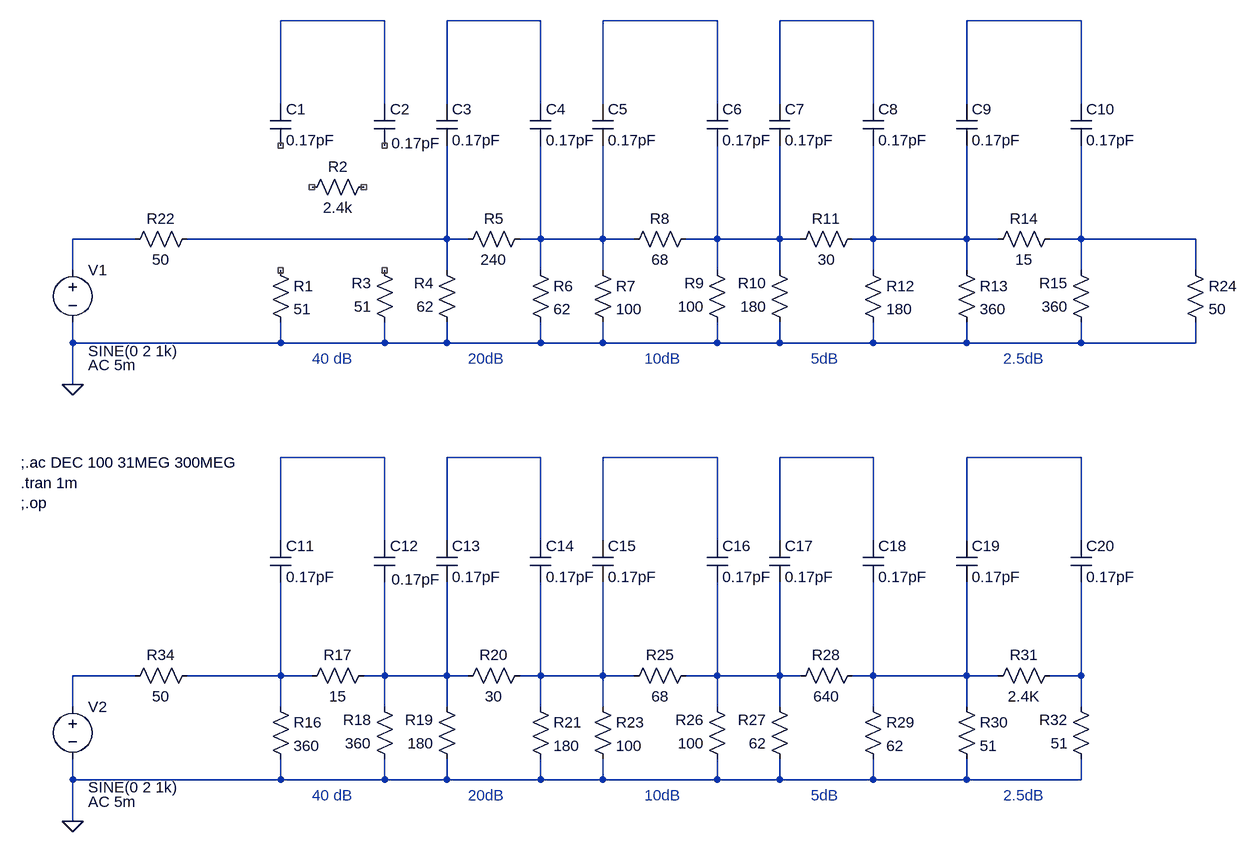
[diagram p0: schematic AttenuatorDesignSim.asc]
AttenuatorDesignSim.asc, the LTspice schematic file:
Version 4
SHEET 1 2180 1200
WIRE 272 -48 112 -48
WIRE 512 -48 368 -48
WIRE 784 -48 608 -48
WIRE 1024 -48 880 -48
WIRE 1344 -48 1168 -48
WIRE 112 80 112 -48
WIRE 272 80 272 -48
WIRE 368 80 368 -48
WIRE 512 80 512 -48
WIRE 608 80 608 -48
WIRE 784 80 784 -48
WIRE 880 80 880 -48
WIRE 1024 80 1024 -48
WIRE 1168 80 1168 -48
WIRE 1344 80 1344 -48
WIRE -112 288 -208 288
WIRE 368 288 368 144
WIRE 368 288 -32 288
WIRE 400 288 368 288
WIRE 512 288 512 144
WIRE 512 288 480 288
WIRE 608 288 608 144
WIRE 608 288 512 288
WIRE 656 288 608 288
WIRE 784 288 784 144
WIRE 784 288 736 288
WIRE 880 288 880 144
WIRE 880 288 784 288
WIRE 912 288 880 288
WIRE 1024 288 1024 144
WIRE 1024 288 992 288
WIRE 1168 288 1168 144
WIRE 1168 288 1024 288
WIRE 1216 288 1168 288
WIRE 1344 288 1344 144
WIRE 1344 288 1296 288
WIRE 1520 288 1344 288
WIRE -208 336 -208 288
WIRE 368 336 368 288
WIRE 512 336 512 288
WIRE 608 336 608 288
WIRE 784 336 784 288
WIRE 880 336 880 288
WIRE 1024 336 1024 288
WIRE 1168 336 1168 288
WIRE 1344 336 1344 288
WIRE 1520 336 1520 288
WIRE -208 448 -208 416
WIRE 112 448 112 416
WIRE 112 448 -208 448
WIRE 272 448 272 416
WIRE 272 448 112 448
WIRE 368 448 368 416
WIRE 368 448 272 448
WIRE 512 448 512 416
WIRE 512 448 368 448
WIRE 608 448 608 416
WIRE 608 448 512 448
WIRE 784 448 784 416
WIRE 784 448 608 448
WIRE 880 448 880 416
WIRE 880 448 784 448
WIRE 1024 448 1024 416
WIRE 1024 448 880 448
WIRE 1168 448 1168 416
WIRE 1168 448 1024 448
WIRE 1344 448 1344 416
WIRE 1344 448 1168 448
WIRE 1520 448 1520 416
WIRE 1520 448 1344 448
WIRE -208 512 -208 448
WIRE 272 624 112 624
WIRE 512 624 368 624
WIRE 784 624 608 624
WIRE 1024 624 880 624
WIRE 1344 624 1168 624
WIRE 112 752 112 624
WIRE 272 752 272 624
WIRE 368 752 368 624
WIRE 512 752 512 624
WIRE 608 752 608 624
WIRE 784 752 784 624
WIRE 880 752 880 624
WIRE 1024 752 1024 624
WIRE 1168 752 1168 624
WIRE 1344 752 1344 624
WIRE -112 960 -208 960
WIRE 112 960 112 816
WIRE 112 960 -32 960
WIRE 160 960 112 960
WIRE 272 960 272 816
WIRE 272 960 240 960
WIRE 368 960 368 816
WIRE 368 960 272 960
WIRE 400 960 368 960
WIRE 512 960 512 816
WIRE 512 960 480 960
WIRE 608 960 608 816
WIRE 608 960 512 960
WIRE 656 960 608 960
WIRE 784 960 784 816
WIRE 784 960 736 960
WIRE 880 960 880 816
WIRE 880 960 784 960
WIRE 912 960 880 960
WIRE 1024 960 1024 816
WIRE 1024 960 992 960
WIRE 1168 960 1168 816
WIRE 1168 960 1024 960
WIRE 1216 960 1168 960
WIRE 1344 960 1344 816
WIRE 1344 960 1296 960
WIRE -208 1008 -208 960
WIRE 112 1008 112 960
WIRE 272 1008 272 960
WIRE 368 1008 368 960
WIRE 512 1008 512 960
WIRE 608 1008 608 960
WIRE 784 1008 784 960
WIRE 880 1008 880 960
WIRE 1024 1008 1024 960
WIRE 1168 1008 1168 960
WIRE 1344 1008 1344 960
WIRE -208 1120 -208 1088
WIRE 112 1120 112 1088
WIRE 112 1120 -208 1120
WIRE 272 1120 272 1088
WIRE 272 1120 112 1120
WIRE 368 1120 368 1088
WIRE 368 1120 272 1120
WIRE 512 1120 512 1088
WIRE 512 1120 368 1120
WIRE 608 1120 608 1088
WIRE 608 1120 512 1120
WIRE 784 1120 784 1088
WIRE 784 1120 608 1120
WIRE 880 1120 880 1088
WIRE 880 1120 784 1120
WIRE 1024 1120 1024 1088
WIRE 1024 1120 880 1120
WIRE 1168 1120 1168 1088
WIRE 1168 1120 1024 1120
WIRE 1344 1120 1344 1088
WIRE 1344 1120 1168 1120
WIRE -208 1184 -208 1120
FLAG -208 512 0
FLAG -208 1184 0
DATAFLAG -160 288 "$"
DATAFLAG 1408 288 "$"
DATAFLAG -160 960 "$"
SYMBOL res 96 320 R0
SYMATTR InstName R1
SYMATTR Value 51
SYMBOL res 256 192 R90
WINDOW 0 0 56 VBottom 2
WINDOW 3 32 56 VTop 2
SYMATTR InstName R2
SYMATTR Value 2.4k
SYMBOL res 288 432 R180
WINDOW 0 36 76 Left 2
WINDOW 3 36 40 Left 2
SYMATTR InstName R3
SYMATTR Value 51
SYMBOL res 384 432 R180
WINDOW 0 36 76 Left 2
WINDOW 3 36 40 Left 2
SYMATTR InstName R4
SYMATTR Value 62
SYMBOL res 384 304 R270
WINDOW 0 32 56 VTop 2
WINDOW 3 0 56 VBottom 2
SYMATTR InstName R5
SYMATTR Value 240
SYMBOL res 496 320 R0
SYMATTR InstName R6
SYMATTR Value 62
SYMBOL res 592 320 R0
SYMATTR InstName R7
SYMATTR Value 100
SYMBOL res 752 272 R90
WINDOW 0 0 56 VBottom 2
WINDOW 3 32 56 VTop 2
SYMATTR InstName R8
SYMATTR Value 68
SYMBOL res 800 432 R180
WINDOW 0 36 76 Left 2
WINDOW 3 36 40 Left 2
SYMATTR InstName R9
SYMATTR Value 100
SYMBOL res 896 432 R180
WINDOW 0 36 76 Left 2
WINDOW 3 36 40 Left 2
SYMATTR InstName R10
SYMATTR Value 180
SYMBOL res 896 304 R270
WINDOW 0 32 56 VTop 2
WINDOW 3 0 56 VBottom 2
SYMATTR InstName R11
SYMATTR Value 30
SYMBOL res 1008 320 R0
SYMATTR InstName R12
SYMATTR Value 180
SYMBOL res 1152 320 R0
SYMATTR InstName R13
SYMATTR Value 360
SYMBOL res 1312 272 R90
WINDOW 0 0 56 VBottom 2
WINDOW 3 32 56 VTop 2
SYMATTR InstName R14
SYMATTR Value 15
SYMBOL res 1360 432 R180
WINDOW 0 36 76 Left 2
WINDOW 3 36 40 Left 2
SYMATTR InstName R15
SYMATTR Value 360
SYMBOL res 1504 320 R0
SYMATTR InstName R24
SYMATTR Value 50
SYMBOL voltage -208 320 R0
WINDOW 3 24 140 Left 2
WINDOW 123 24 162 Left 2
SYMATTR Value SINE(0 2 1k)
SYMATTR Value2 AC 5m
SYMATTR InstName V1
SYMBOL res -16 272 R90
WINDOW 0 0 56 VBottom 2
WINDOW 3 32 56 VTop 2
SYMATTR InstName R22
SYMATTR Value 50
SYMBOL cap 96 80 R0
SYMATTR InstName C1
SYMATTR Value 0.17pF
SYMBOL cap 256 80 R0
WINDOW 3 27 60 Left 2
SYMATTR Value 0.17pF
SYMATTR InstName C2
SYMBOL cap 352 80 R0
SYMATTR InstName C3
SYMATTR Value 0.17pF
SYMBOL cap 496 80 R0
SYMATTR InstName C4
SYMATTR Value 0.17pF
SYMBOL cap 592 80 R0
SYMATTR InstName C5
SYMATTR Value 0.17pF
SYMBOL cap 768 80 R0
SYMATTR InstName C6
SYMATTR Value 0.17pF
SYMBOL cap 864 80 R0
SYMATTR InstName C7
SYMATTR Value 0.17pF
SYMBOL cap 1008 80 R0
SYMATTR InstName C8
SYMATTR Value 0.17pF
SYMBOL cap 1152 80 R0
SYMATTR InstName C9
SYMATTR Value 0.17pF
SYMBOL cap 1328 80 R0
SYMATTR InstName C10
SYMATTR Value 0.17pF
SYMBOL res 96 992 R0
SYMATTR InstName R16
SYMATTR Value 360
SYMBOL res 256 944 R90
WINDOW 0 0 56 VBottom 2
WINDOW 3 32 56 VTop 2
SYMATTR InstName R17
SYMATTR Value 15
SYMBOL res 288 1104 R180
WINDOW 0 36 76 Left 2
WINDOW 3 36 40 Left 2
SYMATTR InstName R18
SYMATTR Value 360
SYMBOL res 384 1104 R180
WINDOW 0 36 76 Left 2
WINDOW 3 36 40 Left 2
SYMATTR InstName R19
SYMATTR Value 180
SYMBOL res 384 976 R270
WINDOW 0 32 56 VTop 2
WINDOW 3 0 56 VBottom 2
SYMATTR InstName R20
SYMATTR Value 30
SYMBOL res 496 992 R0
SYMATTR InstName R21
SYMATTR Value 180
SYMBOL res 592 992 R0
SYMATTR InstName R23
SYMATTR Value 100
SYMBOL res 752 944 R90
WINDOW 0 0 56 VBottom 2
WINDOW 3 32 56 VTop 2
SYMATTR InstName R25
SYMATTR Value 68
SYMBOL res 800 1104 R180
WINDOW 0 36 76 Left 2
WINDOW 3 36 40 Left 2
SYMATTR InstName R26
SYMATTR Value 100
SYMBOL res 896 1104 R180
WINDOW 0 36 76 Left 2
WINDOW 3 36 40 Left 2
SYMATTR InstName R27
SYMATTR Value 62
SYMBOL res 896 976 R270
WINDOW 0 32 56 VTop 2
WINDOW 3 0 56 VBottom 2
SYMATTR InstName R28
SYMATTR Value 640
SYMBOL res 1008 992 R0
SYMATTR InstName R29
SYMATTR Value 62
SYMBOL res 1152 992 R0
SYMATTR InstName R30
SYMATTR Value 51
SYMBOL res 1312 944 R90
WINDOW 0 0 56 VBottom 2
WINDOW 3 32 56 VTop 2
SYMATTR InstName R31
SYMATTR Value 2.4K
SYMBOL res 1360 1104 R180
WINDOW 0 36 76 Left 2
WINDOW 3 36 40 Left 2
SYMATTR InstName R32
SYMATTR Value 51
SYMBOL voltage -208 992 R0
WINDOW 3 24 140 Left 2
WINDOW 123 24 162 Left 2
SYMATTR Value SINE(0 2 1k)
SYMATTR Value2 AC 5m
SYMATTR InstName V2
SYMBOL res -16 944 R90
WINDOW 0 0 56 VBottom 2
WINDOW 3 32 56 VTop 2
SYMATTR InstName R34
SYMATTR Value 50
SYMBOL cap 96 752 R0
SYMATTR InstName C11
SYMATTR Value 0.17pF
SYMBOL cap 256 752 R0
WINDOW 3 27 60 Left 2
SYMATTR Value 0.17pF
SYMATTR InstName C12
SYMBOL cap 352 752 R0
SYMATTR InstName C13
SYMATTR Value 0.17pF
SYMBOL cap 496 752 R0
SYMATTR InstName C14
SYMATTR Value 0.17pF
SYMBOL cap 592 752 R0
SYMATTR InstName C15
SYMATTR Value 0.17pF
SYMBOL cap 768 752 R0
SYMATTR InstName C16
SYMATTR Value 0.17pF
SYMBOL cap 864 752 R0
SYMATTR InstName C17
SYMATTR Value 0.17pF
SYMBOL cap 1008 752 R0
SYMATTR InstName C18
SYMATTR Value 0.17pF
SYMBOL cap 1152 752 R0
SYMATTR InstName C19
SYMATTR Value 0.17pF
SYMBOL cap 1328 752 R0
SYMATTR InstName C20
SYMATTR Value 0.17pF
TEXT -288 632 Left 2 !;.ac DEC 100 31MEG 300MEG\n.tran 1m\n;.op
TEXT 160 472 Left 2 ;40 dB
TEXT 400 472 Left 2 ;20dB
TEXT 672 472 Left 2 ;10dB
TEXT 928 472 Left 2 ;5dB
TEXT 1224 472 Left 2 ;2.5dB
TEXT 160 1144 Left 2 ;40 dB
TEXT 400 1144 Left 2 ;20dB
TEXT 672 1144 Left 2 ;10dB
TEXT 928 1144 Left 2 ;5dB
TEXT 1224 1144 Left 2 ;2.5dB

The netlist it stands for:
* AttenuatorDesignSim.asc
R1 NC_01 0 51
R2 NC_02 NC_03 2.4k
R3 0 NC_04 51
R4 0 N007 62
R5 N007 N008 240
R6 N008 0 62
R7 N008 0 100
R8 N009 N008 68
R9 0 N009 100
R10 0 N009 180
R11 N009 N010 30
R12 N010 0 180
R13 N010 0 360
R14 N011 N010 15
R15 0 N011 360
R24 N011 0 50
V1 N006 0 SINE(0 2 1k) AC 5m
R22 N007 N006 50
C1 N001 NC_05 0.17pF
C2 N001 NC_06 0.17pF
C3 N002 N007 0.17pF
C4 N002 N008 0.17pF
C5 N003 N008 0.17pF
C6 N003 N009 0.17pF
C7 N004 N009 0.17pF
C8 N004 N010 0.17pF
C9 N005 N010 0.17pF
C10 N005 N011 0.17pF
R16 N018 0 360
R17 N019 N018 15
R18 0 N019 360
R19 0 N019 180
R20 N019 N020 30
R21 N020 0 180
R23 N020 0 100
R25 N021 N020 68
R26 0 N021 100
R27 0 N021 62
R28 N021 N022 640
R29 N022 0 62
R30 N022 0 51
R31 N023 N022 2.4K
R32 0 N023 51
V2 N017 0 SINE(0 2 1k) AC 5m
R34 N018 N017 50
C11 N012 N018 0.17pF
C12 N012 N019 0.17pF
C13 N013 N019 0.17pF
C14 N013 N020 0.17pF
C15 N014 N020 0.17pF
C16 N014 N021 0.17pF
C17 N015 N021 0.17pF
C18 N015 N022 0.17pF
C19 N016 N022 0.17pF
C20 N016 N023 0.17pF
;.ac DEC 100 31MEG 300MEG
.tran 1m
;.op
* 40 dB
* 20dB
* 10dB
* 5dB
* 2.5dB
* 40 dB
* 20dB
* 10dB
* 5dB
* 2.5dB
.backanno
.end